# EAGLE board DynoHub (EAGLE 9.6.2)
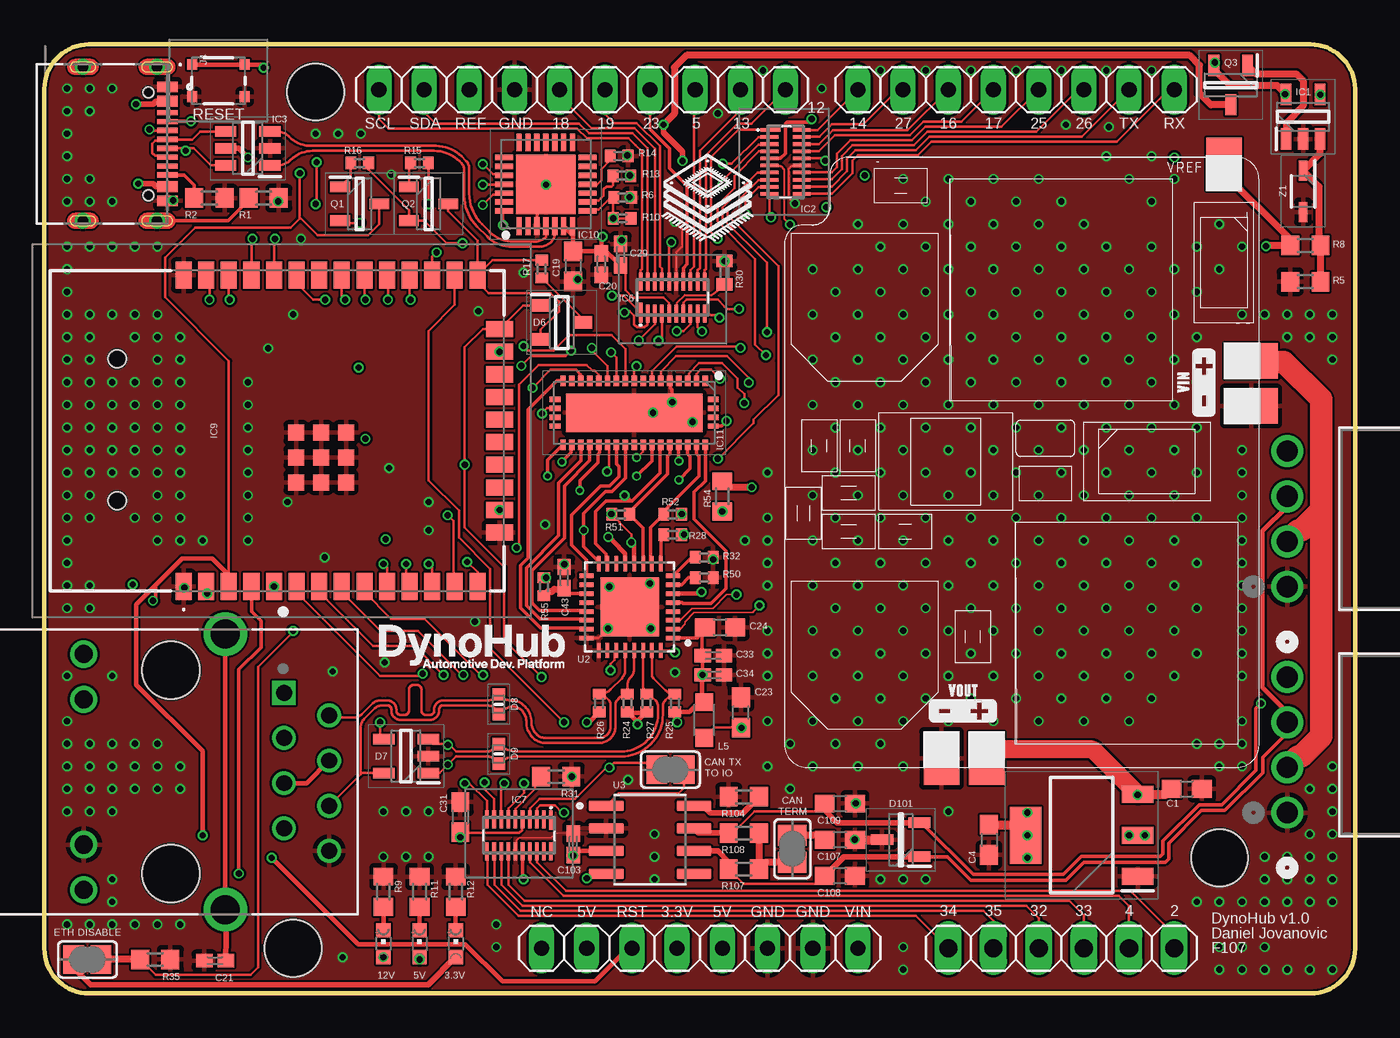
[diagram p5: board, top side]
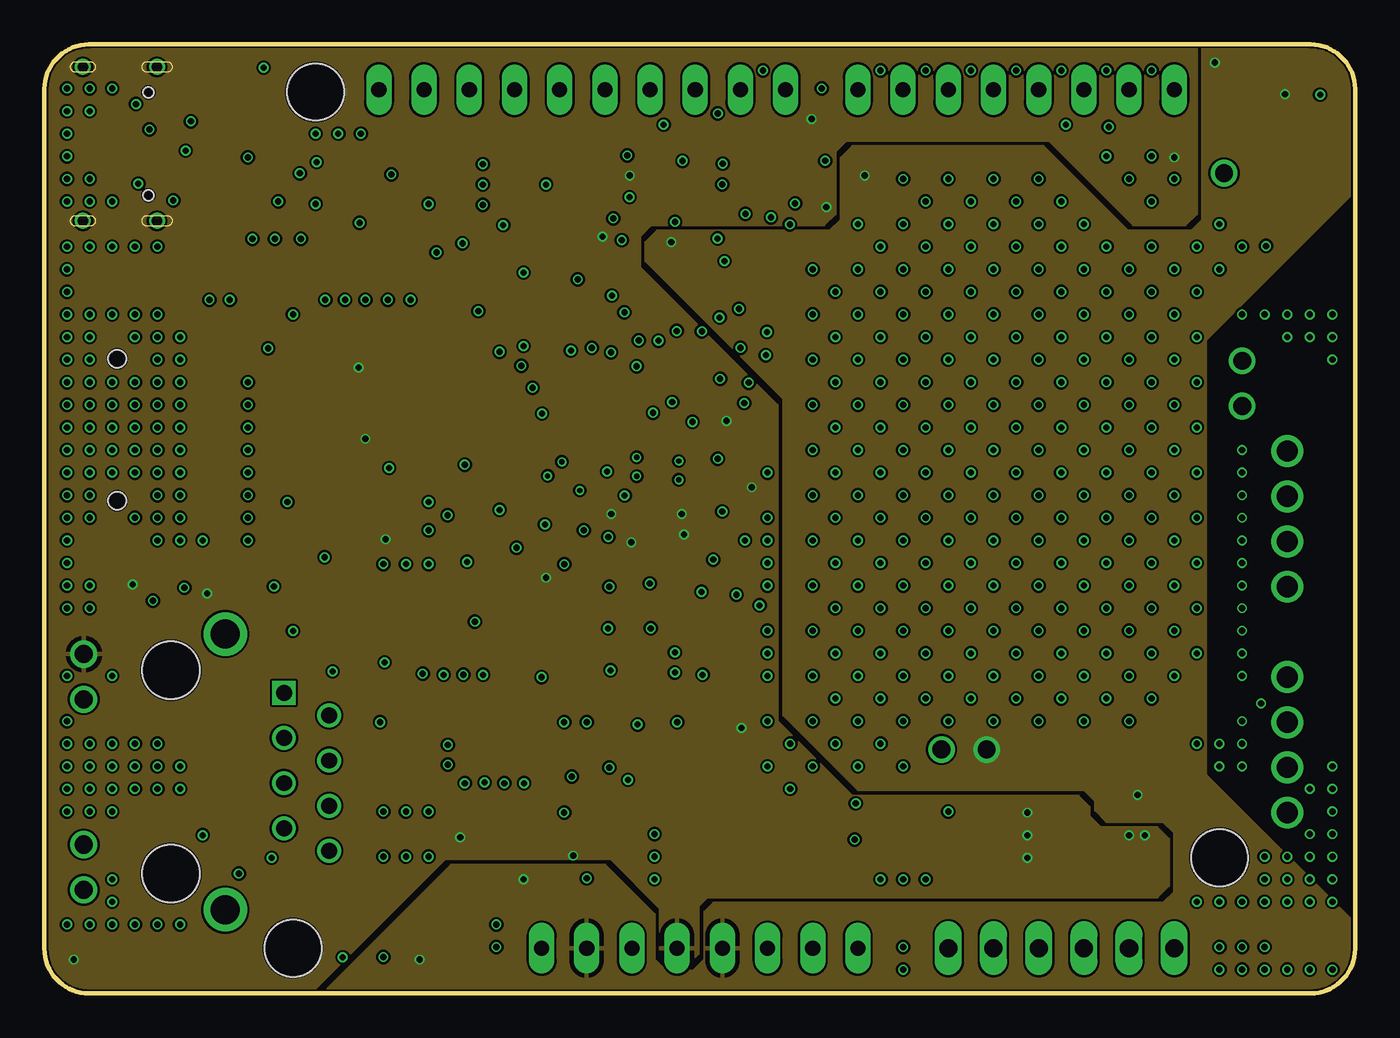
[diagram p6: board, inner layer Route2]
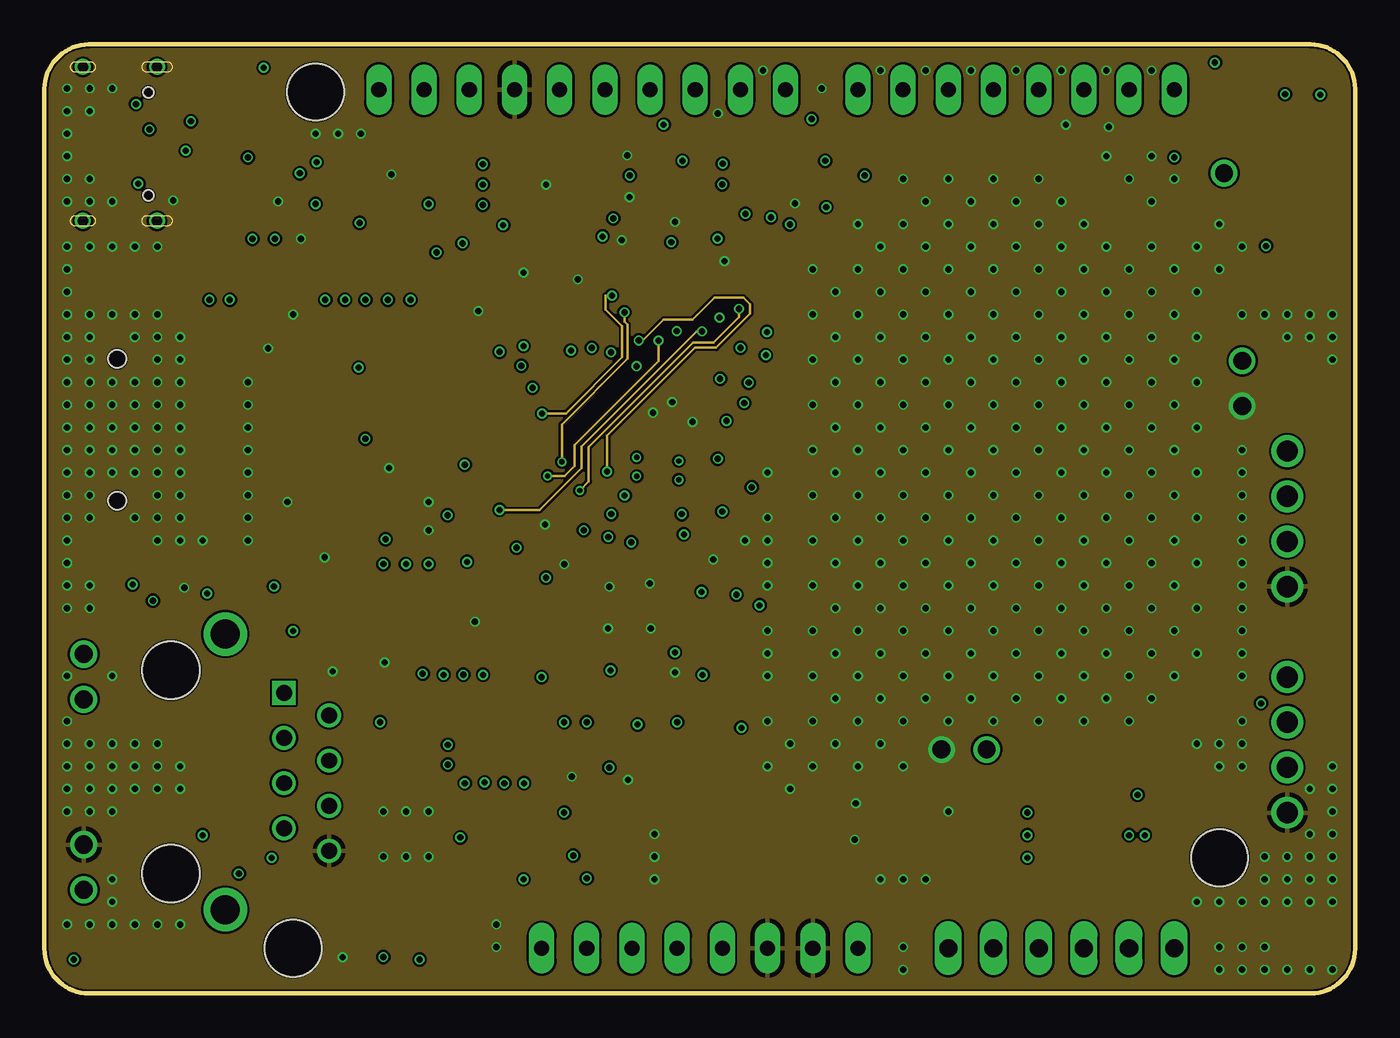
[diagram p7: board, inner layer Route15]
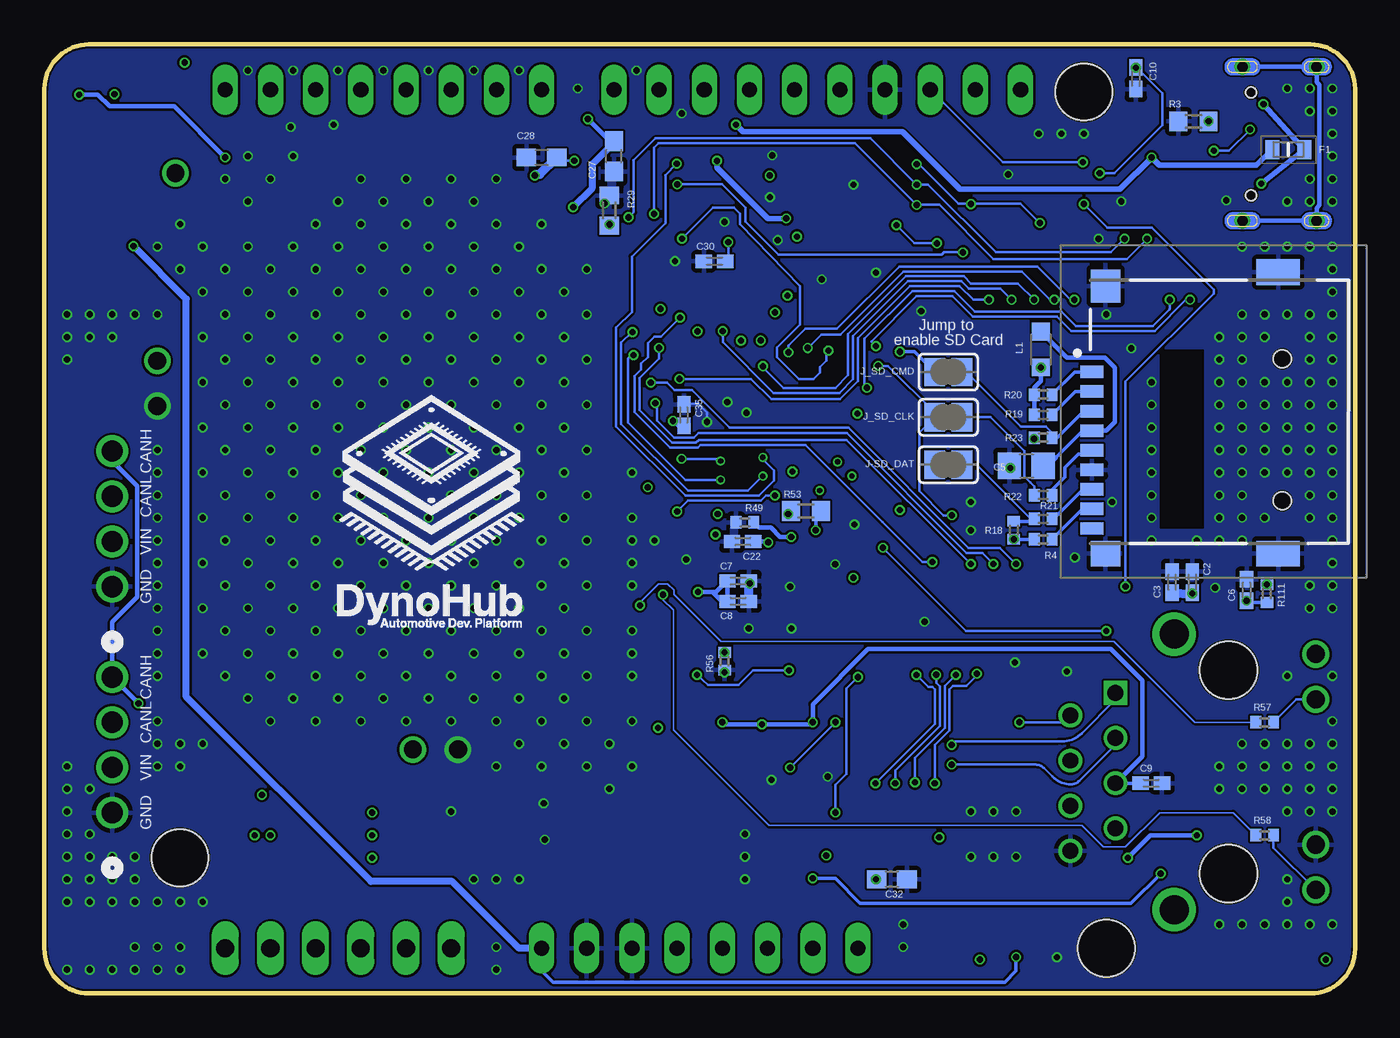
[diagram p8: board, bottom side, seen from below]

Size 73.66 x 53.34 mm. Coordinates in mm from the lower left corner, seen from the top.
Outline: 0,50.84 0,2.5 arc90 2.5,0 71.16,0 arc90 73.66,2.5 73.66,50.84 arc90 71.16,53.34 2.5,53.34 arc90 0,50.84
Copper layers (1*2*15*16): Top 0.035559375mm / dielectric 0.17018125mm / Route2 0.01778125mm / dielectric 47mil / Route15 0.01778125mm / dielectric 0.17018125mm / Bottom 0.035559375mm
Design rules "jlcpcb-4-layer *": minimum track width 3.5mil, minimum drill 0.2mm, track to track 0.126490625mm, track to pad 0.126490625mm, pad to pad 0.126490625mm, via to via 0.126490625mm, smd to smd 0mil, copper to edge 0.1mm, drill to drill 5mil, minimum pad ring 4mil, minimum via ring 4mil, stop-mask expansion 3mil, vias tented up to drill 100mil, thermal gap 10mil
Holes 3.2 mm at 66.04,7.62 15.24,50.67 13.97,2.54

## Footprints (pad centres in the part's own frame; a part is rotated, then mirrored left to right if it is on the bottom)
CHIPLED_0603 = smd 0.8 x 0.8: A 0,-0.75; C 0,0.75
C0603 = smd 1.1 x 1: 1 -0.85,0; 2 0.85,0
C0402K = smd 0.925 x 0.74: 1 -0.6,0; 2 0.6,0
C0805 = smd 1.3 x 1.5: 1 -0.95,0; 2 0.95,0
SJ = smd 1.168 x 1.6: 1 -0.762,0; 2 0.762,0
SOT95P240X120-3N = smd 1 x 0.7: 1 -1.2,0.95; 2 -1.2,-0.95; 3 1.2,0
SOT95P280X145-5N = smd 1.2 x 0.6: 1 -1.25,0.95; 2 -1.25,0; 3 -1.25,-0.95; 4 1.25,-0.95; 5 1.25,0.95
DIONC1006X55N = smd 0.7 x 0.7: 1 -0.55,0; 2 0.55,0
SOT96P237X111-3N = smd 1.25 x 0.6: 1 -1.05,0.955; 2 -1.05,-0.955; 3 1.05,0
FUSC1608X70N = smd 0.77 x 1.07: 1 -0.9,0; 2 0.9,0
TXB0108DQSR = smd 0.2 x 1.1: 1 -1.8,-0.85 | smd 0.2 x 1: 2 -1.4,-0.9; 3 -1,-0.9; 4 -0.6,-0.9; 5 -0.2,-0.9; 6 0.2,-0.9; 7 0.6,-0.9; 8 1,-0.9; 9 1.4,-0.9; 10 1.8,-0.9; 11 1.8,0.9; 12 1.4,0.9; 13 1,0.9; 14 0.6,0.9; 15 0.2,0.9; 16 -0.2,0.9; 17 -0.6,0.9; 18 -1,0.9; 19 -1.4,0.9; 20 -1.8,0.9
SOT95P280X145-6N = smd 1.2 x 0.6: 1 -1.25,0.95; 2 -1.25,0; 3 -1.25,-0.95; 4 1.25,-0.95; 5 1.25,0; 6 1.25,0.95
SOT230P700X180-4N = smd 1.75 x 0.95: 1 -3.15,2.3; 2 -3.15,0; 3 -3.15,-2.3 | smd 1.75 x 3.2: 4 3.15,0
ESP32WROOM32EN8R2 = smd 1.5 x 0.9: 1 -8.75,5.26; 2 -8.75,3.99; 3 -8.75,2.72; 4 -8.75,1.45; 5 -8.75,0.18; 6 -8.75,-1.09; 7 -8.75,-2.36; 8 -8.75,-3.63; 9 -8.75,-4.9; 10 -8.75,-6.17; 11 -8.75,-7.44; 12 -8.75,-8.71; 13 -8.75,-9.98; 14 -8.75,-11.25; 25 8.75,-11.25; 26 8.75,-9.98; 27 8.75,-8.71; 28 8.75,-7.44; 29 8.75,-6.17; 30 8.75,-4.9; 31 8.75,-3.63; 32 8.75,-2.36; 33 8.75,-1.09; 34 8.75,0.18; 35 8.75,1.45; 36 8.75,2.72; 37 8.75,3.99; 38 8.75,5.26 | smd 0.9 x 1.5: 15 -5.715,-12.5; 16 -4.445,-12.5; 17 -3.175,-12.5; 18 -1.905,-12.5; 19 -0.635,-12.5; 20 0.635,-12.5; 21 1.905,-12.5; 22 3.175,-12.5; 23 4.445,-12.5; 24 5.715,-12.5 | smd 0.9 x 0.9: 39 -1.5,-2.46; 40 -2.9,-2.46; 41 -2.9,-3.86; 42 -1.5,-3.86; 43 -0.1,-3.86; 44 -0.1,-2.46; 45 -0.1,-1.06; 46 -1.5,-1.06; 47 -2.9,-1.06
QFN50P500X500X80-29N = smd 1 x 0.3: 1 -2.35,1.5; 2 -2.35,1; 3 -2.35,0.5; 4 -2.35,0; 5 -2.35,-0.5; 6 -2.35,-1; 7 -2.35,-1.5; 15 2.35,-1.5; 16 2.35,-1; 17 2.35,-0.5; 18 2.35,0; 19 2.35,0.5; 20 2.35,1; 21 2.35,1.5 | smd 0.3 x 1: 8 -1.5,-2.35; 9 -1,-2.35; 10 -0.5,-2.35; 11 0,-2.35; 12 0.5,-2.35; 13 1,-2.35; 14 1.5,-2.35; 22 1.5,2.35; 23 1,2.35; 24 0.5,2.35; 25 0,2.35; 26 -0.5,2.35; 27 -1,2.35; 28 -1.5,2.35 | smd 3.35 x 3.35: 29 0,0
QFN50P350X900X80-43N = smd 0.6 x 0.3: 1 -1.8,4; 2 -1.8,3.5; 3 -1.8,3; 4 -1.8,2.5; 5 -1.8,2; 6 -1.8,1.5; 7 -1.8,1; 8 -1.8,0.5; 9 -1.8,0; 10 -1.8,-0.5; 11 -1.8,-1; 12 -1.8,-1.5; 13 -1.8,-2; 14 -1.8,-2.5; 15 -1.8,-3; 16 -1.8,-3.5; 17 -1.8,-4; 22 1.8,-4; 23 1.8,-3.5; 24 1.8,-3; 25 1.8,-2.5; 26 1.8,-2; 27 1.8,-1.5; 28 1.8,-1; 29 1.8,-0.5; 30 1.8,0; 31 1.8,0.5; 32 1.8,1; 33 1.8,1.5; 34 1.8,2; 35 1.8,2.5; 36 1.8,3; 37 1.8,3.5; 38 1.8,4 | smd 0.3 x 0.6: 18 -0.75,-4.45; 19 -0.25,-4.45; 20 0.25,-4.45; 21 0.75,-4.45; 39 0.75,4.45; 40 0.25,4.45; 41 -0.25,4.45; 42 -0.75,4.45 | smd 2.15 x 7.65: 43 0,0
HRO_TYPE-C-31-M-12 = smd 0.6 x 1.14: A1_B12 -3.2,4.75; A4_B9 -2.4,4.75; B1_A12 3.2,4.75; B4_A9 2.4,4.75 | smd 0.3 x 1.14: A5 -1.25,4.75; A6 -0.25,4.75; A7 0.25,4.75; A8 1.25,4.75; B5 1.75,4.75; B6 0.75,4.75; B7 -0.75,4.75; B8 -1.75,4.75 | drill 0.6 pad 0.9: S1 -4.325,4.17; S2 4.325,4.17; S3 -4.325,0; S4 4.325,0 | hole 0.6: -2.89,3.68; 2.89,3.68
CONN_SD-171857-0001_M265_04_MO = drill 1.194 pad 1.702: 1 0,0; 2 2.54,0; 3 5.08,0; 4 7.62,0
HANRUN_HR911105A = drill 0.89 square: 1 4.45,-6.35 | drill 0.89: 2 3.18,-8.89; 3 1.91,-6.35; 4 0.64,-8.89; 5 -0.63,-6.35; 6 -1.9,-8.89; 7 -3.17,-6.35; 8 -4.44,-8.89 | drill 1.02: 9 6.625,4.9; 10 4.085,4.9; 11 -4.085,4.9; 12 -6.625,4.9 | drill 1.63: 15 7.745,-3.05; 16 -7.745,-3.05 | hole 3.25: -5.715,0; 5.715,0
1X06 = drill 1.016 long: 1 -6.35,0; 2 -3.81,0; 3 -1.27,0; 4 1.27,0; 5 3.81,0; 6 6.35,0
1X10 = drill 0.85 pad 1.422 long: 1 -11.43,0; 2 -8.89,0; 3 -6.35,0; 4 -3.81,0; 5 -1.27,0; 6 1.27,0; 7 3.81,0; 8 6.35,0; 9 8.89,0; 10 11.43,0
1X08 = drill 0.85 pad 1.422 long: 1 -8.89,0; 2 -6.35,0; 3 -3.81,0; 4 -1.27,0; 5 1.27,0; 6 3.81,0; 7 6.35,0; 8 8.89,0
L2012C = smd 1 x 1: 1 -1,0; 2 1,0
TF-01A = smd 0.7 x 1.3: 1 2.23,7.174; 2 1.13,7.174; 3 0.03,7.174; 4 -1.07,7.174; 5 -2.17,7.174; 6 -3.27,7.174; 7 -4.37,7.174; 8 -5.47,7.174; CD1 -6.57,7.174 | smd 1.448 x 1.651: MP1 -7.989,6.4 | smd 1.448 x 2.438: MP2 -7.989,-3.3; MP3 7.836,-3.3 | smd 1.854 x 1.651: MP4 7.061,6.4 | hole 1: -5.004,-3.531; 2.972,-3.531
SOT95P240X115-3N = smd 1.1 x 0.6: 1 -1.1,0.95; 2 -1.1,-0.95; 3 1.1,0
SOT95P237X112-3N = smd 1.2 x 0.6: 1 -1.1,0.95; 2 -1.1,-0.95; 3 1.1,0
R0603 = smd 1 x 1.1: 1 -0.85,0; 2 0.85,0
R0402 = smd 0.6 x 0.7: 1 -0.5,0; 2 0.5,0
R0402' = smd 0.7 x 0.9: 1 -0.65,0; 2 0.65,0
EVPAF5B70 = smd 0.55 x 0.6: A1 -1.475,0.9; A2 1.475,0.9; B1 -1.475,-0.9; B2 1.475,-0.9
QFN50P500X500X100-33N = smd 0.86 x 0.26: 1 -2.435,1.75; 2 -2.435,1.25; 3 -2.435,0.75; 4 -2.435,0.25; 5 -2.435,-0.25; 6 -2.435,-0.75; 7 -2.435,-1.25; 8 -2.435,-1.75; 17 2.435,-1.75; 18 2.435,-1.25; 19 2.435,-0.75; 20 2.435,-0.25; 21 2.435,0.25; 22 2.435,0.75; 23 2.435,1.25; 24 2.435,1.75 | smd 0.26 x 0.86: 9 -1.75,-2.435; 10 -1.25,-2.435; 11 -0.75,-2.435; 12 -0.25,-2.435; 13 0.25,-2.435; 14 0.75,-2.435; 15 1.25,-2.435; 16 1.75,-2.435; 25 1.75,2.435; 26 1.25,2.435; 27 0.75,2.435; 28 0.25,2.435; 29 -0.25,2.435; 30 -0.75,2.435; 31 -1.25,2.435; 32 -1.75,2.435 | smd 3.3 x 3.3: 33 0,0
SOIC127P599X175-8N = smd 1.97 x 0.6: 1 -2.47,1.905; 2 -2.47,0.635; 3 -2.47,-0.635; 4 -2.47,-1.905; 5 2.47,-1.905; 6 2.47,-0.635; 7 2.47,0.635; 8 2.47,1.905
2X3MM_PAD = smd 2 x 3: P$1 0,0
SOD2713X115N = smd 1.125 x 0.5: 1 -1.162,0; 2 1.162,0

## Placement (x,y rotation side)
3.3V  C965807  [CHIPLED_0603]  23.11,2.79 0 top
5V  C965807  [CHIPLED_0603]  21.08,2.79 0 top
12V  C965807  [CHIPLED_0603]  19.05,2.79 0 top
C1  1uF  [C0603]  64.2,11.49 0 top
C2  100nF  [C0402K]  9.14,23.11 90 bottom
C3  4.7uF  [C0402K]  10.29,23.11 90 bottom
C4  1uF  [C0603]  53.09,8.64 270 top
C5  47uF  [C0805]  18.48,29.65 0 bottom
C6  100nF  [C0402K]  6.1,22.67 90 bottom
C7  100nF  [C0402K]  34.67,23.18 0 bottom
C8  2.2uF  [C0402K]  34.67,22.03 0 bottom
C9  100nF  [C0402K]  11.46,11.81 0 bottom
C10  100 nF  [C0402K]  12.32,51.44 270 bottom
C19  4.7uF  [C0603]  29.71,40.86 270 top
C20  100nF  [C0402K]  31.3,40.99 270 top
C21  1nF  [C0402K]  9.59,1.84 180 top
C22  100nF  [C0402K]  34.42,25.4 180 bottom
C23  22uF  [C0603]  39.14,15.79 90 top
C24  22uF  [C0603]  37.97,20.57 0 top
C27  100nF  [C0603]  41.66,47.05 90 bottom
C28  100nF  [C0603]  45.72,46.99 0 bottom
C29  100nF  [C0402K]  32.38,41.53 270 top
C30  100nF  [C0402K]  36,41.15 0 bottom
C31  100nF  [C0603]  23.37,9.91 270 top
C32  100nF  [C0603]  26.04,6.41 180 bottom
C33  100nF  [C0402K]  37.59,18.99 0 top
C34  100nF  [C0402K]  37.59,17.91 0 top
C35  100nF  [C0402K]  37.72,32.51 270 bottom
C43  1nF  [C0402K]  29.21,23.37 90 top
C103  100 nF  [C0402K]  29.72,8.38 90 top
C107  4.7nF 100V  [C0603]  44.7,8.64 180 top
C108  100pF 50V  [C0603]  44.7,6.6 180 top
C109  100pF 50V  [C0603]  44.7,10.67 180 top
CAN_TX  [SJ]  35.18,12.57 0 top
D6  BAT54C  [SOT95P240X120-3N]  29.08,37.72 0 top
D7  ESDS314DBVR  [SOT95P280X145-5N]  20.32,13.34 180 top
D8  GG0402052R542P  [DIONC1006X55N]  25.53,16.26 90 top
D9  GG0402052R542P  [DIONC1006X55N]  25.53,13.46 270 top
D101  NUP2105LT1G  [SOT96P237X111-3N]  48.13,8.64 180 top
ETH_EN  [SJ]  2.41,1.91 0 top
F1  MF-FSML050_8-2  [FUSC1608X70N]  3.75,47.43 180 bottom
IC1  LMV321AIDBVR  [SOT95P280X145-5N]  70.74,49.28 90 top
IC2  TXB0108DQSR  [TXB0108DQSR]  41.66,46.74 270 top
IC3  USBLC6-2SC6  [SOT95P280X145-6N]  11.43,47.5 180 top
IC4  TLV1117LV33DCYR  [SOT230P700X180-4N]  58.29,8.89 180 top
IC6  TXB0108DQSR  [TXB0108DQSR]  35.31,39.12 0 top
IC7  TXB0108DQSR  [TXB0108DQSR]  26.67,8.89 180 top
IC9  ESP32-WROOM-32E-N8R2  [ESP32WROOM32EN8R2]  13.08,31.62 90 top
IC10  CP2102N-A02-GQFN28R  [QFN50P500X500X80-29N]  28.18,45.48 90 top
IC11  TS3L501ERUAR  [QFN50P350X900X80-43N]  33.15,32.64 270 top
J4  TYPE-C-31-M-12  [HRO_TYPE-C-31-M-12]  2.16,47.75 270 top
J5  1718570004CONN_SD-171857-0001_M265_04_MO  [CONN_SD-171857-0001_M265_04_MO]  69.85,22.86 90 top
J6  1718570004CONN_SD-171857-0001_M265_04_MO  [CONN_SD-171857-0001_M265_04_MO]  69.85,10.16 90 top
J9  HR911105A  [HANRUN_HR911105A]  7.11,12.45 90 top
J-SD_DAT  [SJ]  22.86,29.72 0 bottom
J_SD_CLK  [SJ]  22.86,32.38 0 bottom
J_SD_CMD  [SJ]  22.86,34.92 0 bottom
JANALOG1  6x1F-H8.5-L14.5mm  [1X06]  57.15,2.54 0 top
JHIGH1  10x1F-H8.5-L14.5mm  [1X10]  30.23,50.8 180 top
JLOW1  8x1F-H8.5-L14.5mm  [1X08]  54.61,50.8 180 top
L1  600R 2A  [L2012C]  17.65,36.2 90 bottom
L5  600R 2A  [L2012C]  37.08,15.37 90 top
MICRO_SD1  TF-01A  [TF-01A]  7.62,32.7 90 bottom
POWER1  8x1F-H8.5-L14.5mm  [1X08]  36.83,2.54 0 top
Q1  SS8050-G  [SOT95P240X115-3N]  17.72,44.39 0 top
Q2  SS8050-G  [SOT95P240X115-3N]  21.59,44.39 0 top
Q3  FDN340P  [SOT95P237X112-3N]  66.67,51.05 270 top
R1  1M  [R0603]  12.32,44.7 180 top
R2  5K1  [R0603]  9.27,44.7 180 top
R3  5K1  [R0603]  9.08,49.02 0 bottom
R4  2.2k  [R0402]  17.53,25.53 180 bottom
R5  10k  [R0603]  70.87,40.01 0 top
R6  47.5k 5%  [R0402]  32.5,44.73 180 top
R8  10k  [R0603]  70.87,42.04 180 top
R9  470  [R0603]  19.05,5.71 270 top
R10  22.1k 5%  [R0402]  32.47,43.56 180 top
R11  100  [R0603]  21.08,5.71 270 top
R12  15  [R0603]  23.11,5.71 270 top
R13  2k 5%  [R0402]  32.46,45.95 180 top
R14  10k 5%  [R0402]  32.3,47.07 180 top
R15  10k 5%  [R0402]  21.08,46.67 0 top
R16  10k 5%  [R0402]  17.72,46.67 0 top
R17  220  [R0402]  27.94,40.72 90 top
R18  2.2k  [R0402]  19.18,26.04 270 bottom
R19  2.2k  [R0402]  17.53,32.51 180 bottom
R20  2.2k  [R0402]  17.53,33.66 180 bottom
R21  10  [R0402]  17.53,26.67 180 bottom
R22  220  [R0402]  17.53,28 180 bottom
R23  10k  [R0402]  17.53,31.24 180 bottom
R24  49,9 1%  [R0402]  32.77,16.32 270 top
R25  49,9 1%  [R0402]  35.43,16.32 270 top
R26  49,9 1%  [R0402]  31.18,16.32 270 top
R27  49,9 1%  [R0402]  33.85,16.32 270 top
R28  2.2k  [R0402]  35.31,25.78 0 top
R29  10k  [R0603]  41.91,44.01 270 bottom
R30  10k  [R0402']  38.23,40.51 270 top
R31  10k  [R0603]  28.77,12.19 180 top
R32  2.2k  [R0402]  37.08,24.51 0 top
R35  10k  [R0603]  6.22,1.91 180 top
R49  2.2k  [R0402]  34.29,26.48 180 bottom
R50  2.2k  [R0402]  37.08,23.37 0 top
R51  2.2k  [R0402]  32.38,26.92 180 top
R52  2.2k  [R0402]  35.31,26.92 0 top
R53  2.2k  [R0603]  30.86,27.11 180 bottom
R54  2.2k  [R0603]  38.1,27.94 90 top
R55  10k  [R0402]  28.07,22.86 90 top
R56  12k 1%  [R0402]  35.43,18.67 90 bottom
R57  2.2k  [R0402]  5.08,15.24 0 bottom
R58  2.2k  [R0402]  5.08,8.89 0 bottom
R104  47K  [R0603]  39.31,11.05 0 top
R107  59  [R0603]  39.31,6.99 180 top
R108  59  [R0603]  39.31,9.02 0 top
R111  10K  [R0402]  4.95,22.48 90 bottom
S3  EVP-AF5B70  [EVPAF5B70]  9.78,51.31 0 top
SJ1  [SJ]  42.04,8.13 270 top
U2  LAN8710A-EZC  [QFN50P500X500X100-33N]  32.89,21.72 180 top
U3  SN65HVD230  [SOIC127P599X175-8N]  34.04,8.64 0 top
U$1  NC  [NC]  77.36,53.33 0 top  (outside the outline)
U$2  NC  [NC]  77.36,52.06 0 top  (outside the outline)
U$3  NC  [NC]  77.36,50.79 0 top  (outside the outline)
U$4  NC  [NC]  77.36,49.52 0 top  (outside the outline)
U$5  NC  [NC]  77.36,48.25 0 top  (outside the outline)
U$6  NC  [NC]  77.36,46.98 0 top  (outside the outline)
U$7  NC  [NC]  77.36,45.71 0 top  (outside the outline)
U$8  2X3MM_PAD  [2X3MM_PAD]  52.96,13.21 0 top
U$9  2X3MM_PAD  [2X3MM_PAD]  66.29,46.61 180 top
U$10  2X3MM_PAD  [2X3MM_PAD]  67.82,35.56 90 top
U$11  2X3MM_PAD  [2X3MM_PAD]  50.42,13.21 0 top
U$12  2X3MM_PAD  [2X3MM_PAD]  67.82,33.02 90 top
U$13  NC  [NC]  77.25,53.07 0 top  (outside the outline)
U$14  NC  [NC]  77.25,51.8 0 top  (outside the outline)
U$15  NC  [NC]  77.25,50.53 0 top  (outside the outline)
U$16  NC  [NC]  77.25,49.26 0 top  (outside the outline)
U$17  NC  [NC]  77.25,47.99 0 top  (outside the outline)
U$18  NC  [NC]  77.25,46.72 0 top  (outside the outline)
U$19  NC  [NC]  77.25,45.45 0 top  (outside the outline)
U$20  NC  [NC]  77.25,53.39 0 top  (outside the outline)
U$21  NC  [NC]  77.25,52.12 0 top  (outside the outline)
U$22  NC  [NC]  77.25,50.85 0 top  (outside the outline)
U$23  NC  [NC]  77.25,49.58 0 top  (outside the outline)
U$24  NC  [NC]  77.25,48.31 0 top  (outside the outline)
U$25  NC  [NC]  77.25,47.04 0 top  (outside the outline)
U$26  NC  [NC]  77.25,45.77 0 top  (outside the outline)
U$27  NC  [NC]  77.25,53.39 0 top  (outside the outline)
U$28  NC  [NC]  77.25,52.12 0 top  (outside the outline)
U$29  NC  [NC]  77.25,50.85 0 top  (outside the outline)
U$30  NC  [NC]  77.25,49.58 0 top  (outside the outline)
U$31  NC  [NC]  77.25,48.31 0 top  (outside the outline)
U$32  NC  [NC]  77.25,47.04 0 top  (outside the outline)
U$33  NC  [NC]  77.25,45.77 0 top  (outside the outline)
U$34  NC  [NC]  77.25,44.5 0 top  (outside the outline)
U$35  NC  [NC]  77.25,43.23 0 top  (outside the outline)
Z1  BZX384C5V1-HE3-08  [SOD2713X115N]  70.74,45.09 270 top

## Tracks (layer width: path | path; a pad name or v marks a point on that pad's centre or on a via)
3V3  (via drill 0.35)
  Top 0.089: R28.2 35.83,25.8 v35.94,25.8 | R52.2 v35.82,26.94 | R51.2 v31.86,26.94
  Top 0.152: C29.2 32.65,40.61 32.65,39.52 33.06,39.11 34.8,39.11 35.11,38.81 IC6.5 | IC7.5 26.85,9.77 26.85,9.18 26.68,9.01 23.37,9.01 C31.2 | IC4.4 v55.24,8.89 | IC4.4 55.24,8.99 v55.24,10.16 | IC4.4 55.24,8.79 v55.24,7.62 | v60.96,8.89 IC4.2 v61.85,8.89 | IC9.2 9.09,23.44 | IC1.4 v71.7,50.52 | R51.2 32.31,26.5 32.31,26.46 32.98,25.78 v32.98,25.36 | R55.2 v28.19,23.37 | C103.1 v29.72,7.75 | L5.1 37.65,14.94 C23.1 v39.16,14.94 v39.17,14.93
  Top 0.2: IC2.5 41.38,46.94 41.66,47.21 41.66,48.9
  Top 0.203: IC11.39 38.04,31.89 v38.33,32.18 | 41.66,48.9 41.72,48.96 42.93,48.96 v43.12,49.15 | C31.2 v23.37,8.76
  Top 0.254: U2.12 33.14,24.76 33.15,24.77 33.15,25.19 v32.98,25.36 | C103.1 29.99,8 U3.3 | IC10.7 29.71,43.1 C19.1 | C19.1 29.71,42.6 IC10.6 | C20.1 31.22,41.71 C19.1 | C20.1 31.62,41.64 C29.2 | v31.37,42.55 31.3,42.47 C20.1 | R13.1 32.91,45.95 v32.89,45.97 | v9.14,22.48 9.14,22.82 IC9.2
  Top 0.305: ETH_EN.1 1.65,1.42 2.59,0.48 21.55,0.48 3.3V.A
  Top 0.406: v39.75,28.45 38.44,28.45 R54.2
  Top 0.508: C4.1 54.57,9.49 v55.24,10.16
  Bottom 0.152: R19.2 | R53.2 31.86,26.96 v31.86,26.94 | R18.2 v19.18,25.53
  Bottom 0.203: v38.33,32.18 38.01,31.86 C35.2 | v19.17,25.53 R4.2
  Bottom 0.254: v32.98,25.36 33.03,25.4 C22.1 | v43.12,49.15 41.87,47.9 C27.2 | v71.7,50.52 70.67,50.52 70.01,49.86 66.37,49.86 v63.5,46.99 | L1.1 v17.65,35.18 17.65,34.42 18.03,34.04 R20.2 18.03,32.53 R19.2 | R23.2 v18.03,31.18 | R18.2 v19.17,25.53 | C2.1 9.16,22.46
  Bottom 0.406: v43.94,44.2 42.86,45.27 42.86,46.62 41.66,47.82 C27.2
  Bottom 0.508: C3.1 9.16,22.46 v9.14,22.48
  other vias: 1.65,1.91 4.95,22.98
  pour Route2: 64.77,53.34 64.77,43.81 64.14,43.18 61.21,43.18 56.45,47.94 45.09,47.94 44.45,47.31 44.45,43.81 43.81,43.18 34.1,43.18 33.46,42.55 33.46,40.83 41.21,33.08 41.21,15.3 45.4,11.11 58.1,11.11 58.74,10.48 58.74,9.97 59.37,9.33 62.55,9.33 63.18,8.7 63.18,6.03 62.55,5.4 37.27,5.4 36.77,4.89 36.77,2.22 36.13,1.59 35.24,1.59 34.61,2.22 34.61,4.76 31.81,7.56 22.54,7.56 14.99,0 2.54,0 arc-90 0,2.54 0,50.8 arc-90 2.54,53.34
5V  (via drill 0.35, 1)
  Top 0.152: IC2.16 43.75,46.94 v43.88,46.8 | IC6.16 35.11,40.66 35.11,42.11 v35.23,42.23 | IC1.5 69.74,50.53 v69.72,50.55 | 5V.A v21.08,1.91 | U$8.P$1 v52.96,13.71
  Top 0.2: IC7.16 26.87,6.47 v26.92,6.41
  Top 0.406: IC1.5 69.29,51.02 66.65,51.02 65.72,51.95 Q3.2
  Top 0.508: C1.1 63.05,11.19 IC4.3 v61.44,11.16
  Top 1.016: IC4.3 58.92,13.71 v52.96,13.71
  Bottom 0.152: v43.88,46.8 44.68,46.8 C28.2 | C30.2 35.23,41.27 v35.23,42.23
  Bottom 0.2: v26.92,6.41 C32.2
  Bottom 0.508: v46.1,45.97 46.04,46.04 45.83,46.04 C28.2
  other vias: 65.79,52.32
  pour Route2: 22.86,7.24 31.5,7.24 34.29,4.45 34.29,1.91 34.92,1.27 36.45,1.27 37.08,1.91 37.08,4.57 37.59,5.08 62.87,5.08 63.5,5.71 63.5,9.02 62.87,9.65 59.69,9.65 59.05,10.29 59.05,10.79 58.42,11.43 45.72,11.43 41.53,15.62 41.53,33.4 33.78,41.15 33.78,42.23 34.42,42.86 44.13,42.86 44.77,43.5 44.77,46.99 45.4,47.62 56.13,47.62 60.9,42.86 64.45,42.86 65.09,43.5 65.09,53.34 71.12,53.34 arc-90 73.66,50.8 73.66,45.09 65.28,36.7 65.28,12.32 73.66,3.94 73.66,2.54 arc-90 71.12,0 15.62,0
12V  (via drill 0.35, 1)
  Top 0.152: U$9.P$1 v66.29,46.11
  Top 0.203: 68.68,42.04 v68.66,42.01
  Top 0.406: v66.29,46.11 70.02,42.39 R8.2 68.68,42.04
  Bottom 0.203: POWER1.8 45.72,1.27 45.09,0.64 19.68,0.64 19.05,1.27 12V.A
  Bottom 0.406: v68.66,42.01 65.68,39.04 65.68,16.66 55.31,6.29 50.74,6.29 46.99,2.54 POWER1.8
  other vias: 19.05,2.04
!ETH_EN  (via drill 0.35)
  Top 0.15: 31.15,34.78 IC11.13
  Top 0.152: R35.2 6.24,1.04 11.58,1.04 12,1.46 12,18.35 13.97,20.32 v13.97,20.38 | v26.53,25.05 26.67,25.19 26.67,34.23 27.77,35.33 30.48,35.33 30.8,35.02 30.91,35.02 31.15,34.78
  Top 0.406: R35.2 ETH_EN.2
  Bottom 0.152: v13.97,20.38 21.86,20.38 v26.53,25.05
A0/ADC1_6/GPIO34  (via drill 0.35)
  Top 0.152: IC7.10 24.87,10.82 23.88,11.81 v23.62,11.81 | v21.26,17.97 21.13,17.85 18.88,17.85 14.21,22.52 14.21,22.84 IC9.6
  Bottom 0.152: v23.62,11.81 23.62,13.96 22.78,14.79 22.78,17.09 22.61,17.27 21.84,17.27 21.26,17.86 v21.26,17.97
A0/ADC1_6/GPIO34_5V
  Top 0.152: IC7.11 24.89,7.97 24.89,6.11 26.64,4.36 48.98,4.36 JANALOG1.1
A1/ADC1_7/GPIO35  (via drill 0.35)
  Top 0.152: IC7.9 25.27,10.93 24.73,11.46 v24.73,11.85 | IC9.7 15.41,22.84 15.41,22.58 18.47,19.53 20.79,19.53 22.41,17.91 v22.43,17.91
  Bottom 0.152: v24.73,11.85 24.73,13.24 23.06,14.91 23.06,17.27 v22.43,17.91
A1/ADC1_7/GPIO35_5V
  Top 0.15: 26.75,4.65 52.78,4.65
  Top 0.152: IC7.12 25.29,7.97 25.29,6.11 26.75,4.65 | 52.78,4.65 53.34,4.09 JANALOG1.2
A2/ADC1_4/GPIO32  (via drill 0.35)
  Top 0.152: v25.84,11.81 25.67,11.64 IC7.8 | IC9.8 16.68,22.84 16.68,22.58 18.89,20.38 20.99,20.38 23.45,17.91 v23.54,17.91
  Bottom 0.152: v25.84,11.81 25.84,12.53 23.34,15.03 23.34,17.27 23.54,17.46 v23.54,17.91
A2/ADC1_4/GPIO32_5V
  Top 0.152: IC7.13 25.69,7.97 25.69,6.11 26.87,4.93 55.18,4.93 55.88,4.23 JANALOG1.3
A3/ADC1_5/GPIO33  (via drill 0.35)
  Top 0.152: IC7.7 26.09,9.81 26.09,10.4 26.95,11.26 v26.95,11.81 | IC9.9 17.95,22.84 17.95,22.58 19.5,21.04 21.38,21.04 24.5,17.91 v24.65,17.91
  Bottom 0.152: v26.95,11.81 23.62,15.14 23.62,17.08 23.76,17.22 23.96,17.22 v24.65,17.91
A3/ADC1_5/GPIO33_5V
  Top 0.152: IC7.14 26.09,7.97 26.09,6.11 26.99,5.21 57.59,5.21 58.42,4.38 JANALOG1.4
A4/TXCAN/ADC2_0/GPIO4  (via drill 0.35)
  Top 0.152: IC9.26 23.06,38.7 21.59,37.23 21.59,28.84 23.29,27.14 23.29,25.61 25.06,23.85 25.06,19.39 v29.21,15.24 | IC7.4 27.29,9.81 27.29,10.4 27.84,10.95 29.81,10.95 31.55,12.69 v31.75,12.69 32.02,12.95 34.04,12.95 CAN_TX.1
  Bottom 0.152: v31.75,12.69 29.21,15.23 v29.21,15.24
A4/TXCAN/ADC2_0/GPIO4_5V
  Top 0.152: IC7.17 27.29,7.97 27.29,7.38 29.18,5.49 60.39,5.49 60.96,4.91 JANALOG1.5
A5/ADC2_2/SD_DAT0/GPIO2  (via drill 0.35)
  Top 0.152: D6.1 26.91,38.67 IC9.24 24.64,37.34 23.62,36.32 J-SD_DAT.1 23.62,26.18 25.84,23.96 25.84,19.88 v27.94,17.78 | v29.21,10.16 29.09,10.16 28.68,10.57 27.86,10.57 27.69,10.4 27.69,9.81 IC7.3
  Bottom 0.152: v29.21,10.16 29.21,11.71 28.57,12.35 28.57,17.14 v27.94,17.78
  other vias: 23.62,29.72
A5/ADC2_2/SD_DATO/GPIO2_5V
  Top 0.152: IC7.18 27.69,7.97 27.69,7.38 29.3,5.76 61.04,5.76 63.5,3.3 JANALOG1.6
AREF/GPI39  (via drill 0.35)
  Top 0.152: v15.3,46.72 15.3,44.43 v15.24,44.37
  Bottom 0.152: JHIGH1.8 19.8,46.72 v15.3,46.72 | v15.24,44.37 13.92,43.05 11.42,43.05 7.94,39.57 7.94,39.35 12.9,34.38 IC9.5
  other vias: 12.9,22.87
CANGND_BF_C
  Top 0.406: C107.2 43.6,8.89 SJ1.1
CANH_P  (via drill 0.35)
  Top 0.152: R108.1 38.69,9.02 39.9,10.22 43.41,10.22 | 43.41,10.22 43.92,10.22 | C109.2 43.41,10.22
  Top 0.203: D101.2 49.3,9.59 52.21,6.68 57.26,6.68 58.27,7.7 62.73,7.7 62.87,7.83 62.87,8.57 64.9,10.6 66.17,10.6 68.09,12.53 68.09,16.02 v68.37,16.3
  Top 0.305: U3.7 36.76,9.02 R108.1 | D101.2 44.55,9.59 43.92,10.22
  Bottom 0.254: J5.4 69.85,29.92 68.45,28.52 68.45,22.28 69.85,20.88 J6.4 v68.37,16.3
CANL_BF_JMP
  Top 0.406: R108.2 R107.1 40.54,7.37 SJ1.2
CANL_N
  Top 0.152: R107.2 39.28,6.16 43.43,6.16 43.85,6.58 C108.2
  Top 0.203: D101.1 50.74,7.68 52.07,6.35 57.39,6.35 58.41,7.37 62.99,7.37 63.2,7.57 63.2,8.44 65.03,10.27 66.34,10.27 68.47,12.4 68.47,13.27 69.85,14.65 J6.3
  Top 0.254: J5.3 69.85,27.38 68.45,25.98 68.45,17.2 69.85,15.8 J6.3
  Top 0.305: U3.6 37.86,8 38.46,7.41 R107.2 | D101.1 44.93,7.68 C108.2
CC1  (via drill 0.35)
  Top 0.203: J4.A5 6.93,49.02 R3.2
  other vias: 8.23,49.02
CC2
  Top 0.203: R2.2 8.42,45.43 7.85,46 J4.B5
CLK
  Bottom 0.203: R22.1 17.03,28.3 16.31,29.02 16.31,29.56 15.54,30.33 15,30.33 MICRO_SD1.5
CMP
  Top 0.406: IC1.3 71.69,47.2 Z1.1 71.63,45.36 71.63,42.12 R8.1 R5.2
CS/D10/GPIO5  (via drill 0.35)
  Top 0.152: IC6.8 36.31,37.62 35.92,37.23 v35.54,37.23 | v19.3,38.99 19.3,40.32 IC9.29
  Bottom 0.15: v19.3,38.99 19.94,39.62 21.7,39.62 22.11,40.03 25.13,40.03 28.22,36.95 28.22,34.53 28.99,33.76 30.01,33.76 32.68,33.76 35.54,36.61 v35.54,37.23
CS/D10/GPIO5_5V
  Top 0.152: IC6.13 36.31,40.65 36.5,40.84 36.5,50.72 JHIGH1.3
D0/UART_RXD  (via drill 0.35)
  Top 0.152: IC10.25 25.81,45.47 v24.64,45.47 | IC9.34 12.9,42.37 v12.95,42.42 | IC2.10 40.76,43.7 v40.83,43.62
  Bottom 0.152: v12.95,42.42 13.72,41.66 20.19,41.66 24,45.47 v24.64,45.47 27.24,48.07 39.31,48.07 40.55,46.83 40.55,43.91 v40.83,43.62
D0/UART_RXD_5V
  Top 0.152: JLOW1.1 63.2,50.8 60.27,47.88 49.85,47.88 49.09,47.12 45.72,47.12 45.4,46.8 45.4,46.11 44.25,44.96 42.58,44.96 IC2.11
D1/UART_TXD  (via drill 0.35)
  Top 0.152: IC10.26 25.8,44.96 25.4,44.96 25.35,44.91 25.21,44.91 24.64,44.33 v24.64,44.32 | IC9.35 11.63,42.37 v11.68,42.42 | IC2.9 40.73,45.31 40.14,45.31 39.41,44.58 v39.41,43.82 v39.4,43.81
  Bottom 0.152: v11.68,42.42 12.83,41.27 20.32,41.27 23.37,44.32 v24.64,44.32 28.11,47.79 39.14,47.79 39.4,47.53 v39.4,43.81
D1/UART_TXD_5V
  Top 0.152: JLOW1.2 58.32,48.16 49.74,48.16 48.98,47.4 45.57,47.4 45.1,46.93 45.1,46.21 44.25,45.36 42.58,45.36 IC2.12
D2/EMAC_RXD1/GPIO26  (via drill 0.35)
  Top 0.15: IC9.11 20.32,23.07 v20.32,24.13 | IC11.3 36.22,34.51 36.22,34.85 36.8,35.43 38.07,35.43 38.95,34.55 38.95,34.07 39.33,33.68 v39.33,33.18
  Bottom 0.15: v20.32,24.13 20.95,24.77 21.83,24.77 28.56,31.49 36.9,31.49 37.16,31.24 38.28,31.24 39.24,32.2 39.24,33.09 v39.33,33.18
D2/GPIO26  (via drill 0.3, 0.35)
  Top 0.15: v37.85,30.05 39.86,32.06 39.86,32.25 41.24,33.63 41.24,35.56
  Top 0.152: IC2.8 40.73,45.71 40.14,45.71 38.39,43.96 38.39,43.74 41.24,40.89 41.24,35.56
  Top 0.2: IC11.35 v35.65,29.93
  Bottom 0.15: v37.85,30.05 35.78,30.05 v35.65,29.93
D2/GPIO26_5V
  Top 0.152: IC2.13 42.58,45.76 44.25,45.76 44.82,46.33 44.82,47.07 45.42,47.68 48.86,47.68 49.62,48.44 55.75,48.44 58.12,50.8 JLOW1.3
D3/EMAC_RXD0/GPIO25  (via drill 0.35)
  Top 0.15: IC9.10 19.25,23.93 v19.05,24.13 | IC11.6 34.65,34.95 35.51,35.81 38.35,35.81 39.58,34.58 v39.58,34.33
  Bottom 0.15: v19.05,24.13 19.96,25.04 21.72,25.04 28.47,31.8 35.16,31.8 37.28,33.91 38.24,33.91 38.66,34.33 v39.58,34.33
D3/GPIO25  (via drill 0.3, 0.35)
  Top 0.152: IC2.7 40.06,46.14 38.11,44.18 38.11,43.56 40.61,41.06 v40.61,37.18
  Top 0.2: IC11.32 34.15,29.94 v33.28,29.07
  Bottom 0.15: 37.5,28.25 41.24,32
  Bottom 0.152: v33.28,29.07 33.28,29.11 34.13,28.25 37.5,28.25 | v40.61,37.18 40.65,37.18 41.24,36.59 41.24,32
D3/GPIO25_5V
  Top 0.152: IC2.14 42.58,46.16 44.25,46.16 44.54,46.45 44.54,47.19 45.3,47.95 48.74,47.95 49.51,48.71 53.79,48.71 JLOW1.4
D4/EMAC_CO180/GPIO17  (via drill 0.35)
  Top 0.15: IC9.28 20.52,39.04 v20.57,38.99 | IC11.2 36.65,34.82 36.88,35.05 37.47,35.05 v37.97,34.54
  Bottom 0.15: v20.57,38.99 21.46,38.99 22.23,39.75 25.02,39.75 27.94,36.83 27.94,34.42 28.96,33.4 32.8,33.4 33.95,34.54 v37.97,34.54
D4/GPIO17  (via drill 0.3, 0.35)
  Top 0.152: IC2.4 40.16,47.34 38.77,45.94 38.77,45.25 37.81,44.3 37.81,43.4 39.95,41.27 39.95,36.47 v40.55,35.87
  Top 0.2: IC11.36 36.15,30.33 36.29,30.19 36.29,29.5 v35.65,28.86
  Bottom 0.152: v35.65,28.86 37.63,28.86 40.86,32.1 40.86,35.7 40.68,35.87 v40.55,35.87
D4/GPIO17_5V
  Top 0.152: IC2.17 43.53,47.34 44.09,47.9 44.09,47.91 44.42,48.23 48.63,48.23 49.39,48.99 51.53,48.99 JLOW1.5
D5/GPIO16  (via drill 0.35)
  Top 0.152: IC2.3 40.73,47.71 40.14,47.71 38.11,45.68 38.11,45.46 v38.1,45.48 | IC9.27 21.79,41.41 v22.04,41.66
  Bottom 0.152: v22.04,41.66 23.11,41.66 23.23,41.53 32.42,41.53 34.26,43.38 34.26,44.16 35.58,45.48 v38.1,45.48
D5/GPIO16_5V
  Top 0.152: IC2.18 43.53,47.74 44.31,48.51 48.51,48.51 JLOW1.6
D6/EMAC_RX_CRS_DV/GPIO27  (via drill 0.35)
  Top 0.15: IC9.12 21.79,23.93 v21.59,24.13 | IC11.7 34.15,34.97 35.52,36.34 39.06,36.34 v39.12,36.29
  Bottom 0.15: v21.59,24.13 28.57,31.11 36.88,31.11 37.04,30.96 38.4,30.96 40.22,32.78 40.22,34.59 39.12,35.7 v39.12,36.29
D6/GPIO27  (via drill 0.3, 0.35)
  Top 0.102: IC11.31 33.65,30.48
  Top 0.152: v38.12,46.64 38.63,46.64 40.12,48.14 IC2.2 | 33.65,30.48 33.65,30.46 33.31,30.13 v33.28,30.13
  Bottom 0.15: 41.52,33.02 41.52,31.87 37.63,27.98 33.52,27.98 32.67,28.82 32.67,29.32
  Bottom 0.152: 41.52,33.02 41.52,37.42 40.64,38.3 40.64,41.43 38.77,43.3 38.77,46 v38.12,46.64 | 32.67,29.32 32.67,29.39 33.28,30 v33.28,30.13
D6/GPIO27_5V
  Top 0.152: IC2.19 42.58,48.16 43.55,48.16 44.26,48.87 46.02,48.87 47.96,50.8 JLOW1.7
D7/SD_CLK/GPIO14  (via drill 0.35)
  Top 0.152: IC2.1 39.01,48.54 37.46,46.99 37.46,42.8 v37.83,42.43 | v29.59,36.13 29.27,35.81 27.34,35.81 v26.8,35.28 | v22.66,26.88 22.99,26.54 22.99,22.95 IC9.13
  Bottom 0.152: v37.83,42.43 36.09,44.17 34.9,44.17 34.56,43.84 34.56,43.25 31.18,39.77 31.18,37.59 32.48,36.3 32.48,35.77 31.24,34.54 30.44,34.54 30.07,34.91 30.07,35.21 29.72,35.56 29.72,36 v29.59,36.13 | v26.8,35.28 26.25,35.28 23.62,32.64 J_SD_CLK.1 24.48,31.52 24.48,28.23 23.12,26.88 v22.66,26.88
D7/SD_CLK/GPIO14_5V
  Top 0.152: IC2.20 42.58,48.51 43.43,48.51 JLOW1.8
D8/GPIO12  (via drill 0.35)
  Top 0.15: 37.36,38.22 37.44,38.14 37.8,38.14 v37.95,37.99
  Top 0.152: IC6.10 37.36,38.22 | v23.75,24.26 24.33,23.68 IC9.14
  Bottom 0.15: 26.57,26.5 30.89,30.83 36.78,30.83 36.93,30.68 38.51,30.68 40.49,32.66 40.49,34.71 40.13,35.07 40.13,35.39 39.75,35.77 39.75,36.55 39.38,36.92 39.02,36.92 v37.95,37.99
  Bottom 0.152: v23.75,24.26 24.32,24.26 26.57,26.5
D8/GPIO12_5V
  Top 0.152: IC6.11 37.11,40.65 37.17,40.72 37.17,47.12 38.94,48.9 39.75,48.9 JHIGH1.1
D9/GPIO13  (via drill 0.35)
  Top 0.152: IC6.9 36.71,37.45 v36.95,37.21
  Route15 0.15: v36.95,37.21 36.65,37.21 30.19,30.75 30.19,29.54 27.83,27.18 IC9.16
  other vias: 25.58,27.18
D9/GPIO13_5V
  Top 0.152: IC6.12 36.71,40.65 36.83,40.78 36.83,47.37 39.12,49.66 JHIGH1.2
DAT0
  Bottom 0.203: MICRO_SD1.7 15.3,28.33 16.96,26.67 R21.1
DAT1
  Bottom 0.203: R4.1 15.32,27.23 MICRO_SD1.8
DAT2
  Bottom 0.203: R20.1 15.75,34.93 MICRO_SD1.1
DAT3
  Bottom 0.203: R19.1 15.71,33.83 MICRO_SD1.2
EMAC_CO180
  Top 0.2: U2.5 35.84,21.97 35.89,21.91 37.45,21.91 38.31,22.77 38.31,24.86 36.51,26.66 36.51,28.17 37.15,28.81 IC11.38
EMAC_MDC
  Top 0.2: U2.17 30.46,24.38 29.61,25.22
  Top 0.203: 29.61,25.22 29.61,26.89 31.25,28.53 31.75,28.53 32.28,29.06 32.28,29.61 32.15,29.75 IC11.28
EMAC_MDIO  (via drill 0.35)
  Top 0.2: U2.16 31.14,24.28 30.31,25.11 v30.31,26.04
  Top 0.203: IC11.29 32.65,30.4 32.65,30.39 32.65,28.96 31.89,28.2 31.55,28.2 30.31,26.96 v30.31,26.04
  Bottom 0.203: R53.1 30.31,26.82 v30.31,26.04
EMAC_RX_CRS_DV  (via drill 0.35)
  Top 0.15: 33.02,27.68 32.71,27.99 v32.61,27.99
  Top 0.2: U2.15 31.57,24.22 31.57,24.69 30.97,25.29 30.97,27.09 31.55,27.68 33.02,27.68 34.6,29.26 34.6,30.79 IC11.33
  Bottom 0.15: v32.61,27.99 33.11,27.99 33.4,27.7 37.49,27.7 R54.1
  other vias: 38.1,27.09
EMAC_RXD0
  Top 0.2: U2.11 33.64,26.16 R51.1 32.88,27.06 35.02,29.2 35.02,30.2 35.15,30.33 IC11.34
EMAC_RXD1
  Top 0.2: U2.10 34.07,24.22 34.07,26.19 R52.1 34.81,27.1 36.77,29.07 36.77,30.2 36.65,30.33 IC11.37
EMAC_TX_EN
  Top 0.2: U2.21 30.39,21.54 27.82,21.54 27.42,21.94 27.42,23.78 29.22,25.59 29.22,28.53 30.65,29.95 IC11.25
EMAC_TXD0
  Top 0.2: U2.22 30.39,21.04 27.85,21.04 27.09,21.8 27.09,23.92 28.9,25.73 28.9,28.7 30.15,29.95 IC11.24
EMAC_TXD1
  Top 0.2: U2.23 30.39,20.54 27.89,20.54 26.76,21.66 26.76,24.05 27.19,24.48 27.19,32.82 | 28.81,34.44 IC11.17
  Top 0.203: 27.19,32.82 28.81,34.44
ESP_EN  (via drill 0.35)
  Top 0.152: Q1.3 18.82,43.24 18.18,42.61 15.37,42.61 14.35,43.62 | IC9.3 10.36,35.54 6.78,39.13 6.78,41.36 8.47,43.05 13.84,43.05 14.35,43.56 14.35,43.62 | 14.35,43.62 v14.35,46.1
  Top 0.203: 6.25,22.96 6.25,22.17 C6.1
  Top 0.254: S3.A1 S3.A2 12.2,52.21 v12.32,52.03 | POWER1.3 32.79,2.54 30.93,0.68 25.74,0.68 23.65,2.77 17.61,2.77 v12.77,7.62 | v8.89,8.89 8.89,13.62 5.16,17.35 5.16,21.87 6.25,22.96 7.74,24.46 9.42,24.46 10.36,23.52 IC9.3
  Bottom 0.152: 12.09,51.86 10.82,50.59 10.82,48.8 13.53,46.1 v14.35,46.1
  Bottom 0.203: C6.1 6.06,21.98 R111.1
  Bottom 0.254: 12.09,51.86 v12.32,52.03 | v12.77,7.62 11.5,8.89 v8.89,8.89
  other vias: 6.1,22.07
ETH_LED_G
  Bottom 0.152: J9.10 3.29,16.53 R57.2
ETH_LED_Y
  Bottom 0.152: R58.2 4.58,8.19 J9.12
ETH_VDDCR  (via drill 0.35)
  Top 0.254: U2.6 36.83,22.47 v36.93,22.57
  Bottom 0.254: v36.93,22.57 35.93,22.57 C7.1 C8.1 35.58,22.04 36.11,22.57 v36.93,22.57
GND  (via drill 0.35, 1)
  Top 0.089: IC7.15 26.53,8.05 26.53,8.59 26.67,8.73 28.46,8.73 28.76,9.03 C103.2
  Top 0.102: IC6.15 35.51,41.64 35.84,41.98 35.84,42.97 v35.44,43.37 | IC2.15 42.51,46.49 41.95,46.49 41.8,46.34 41.8,44.73 42.13,44.4 v42.19,44.4
  Top 0.15: U2.33 31.14,19.97 U2.24
  Top 0.152: IC10.3 27.68,44.98 IC10.29 | v29.97,40.13 29.83,40.13 C19.2 | U$12.P$1 v67.32,33.02 | U$11.P$1 v50.42,13.71
  Top 0.203: IC11.5 35.2,34.39 35.2,34.01 35.28,33.93 v35.28,33.24
  Top 0.508: U2.33 34.02,22.84 v34.02,23.04 | C107.1 D101.3
  Bottom 0.102: v42.19,44.4 41.91,44.68 R29.1
  Bottom 0.152: C35.1 36.92,33.16 36.42,32.66 v36.42,32.12
  Bottom 0.508: C8.2 C7.2
  other vias: 28.19,45.47 13.97,38.16 32.45,42.34 37.59,24.38 7.24,44.58 38.22,41.16 7.86,22.8 34.2,32.64 32.88,44.76 32.76,47.1 29.64,12.18 31.75,22.86 31.68,20.52 34.08,20.52 29.22,24.12 32.8,12 45.6,10.68 45.54,8.64 13.14,44.52 24.38,38.35 16.76,2.03 12.57,36.26 21.59,26.04 16.19,18.1 14.41,42.42 26.92,40.51 15.75,24.51 21.59,27.62 19.11,18.61 24.19,20.89 19.49,46.04 28.13,26.35 35.43,18.03 1.27,38.16 1.27,36.89 1.27,35.62 1.27,34.35 1.27,33.08 1.27,31.81 1.27,30.54 1.27,29.27 1.27,28 1.27,26.73 2.54,26.73 2.54,28 2.54,29.27 2.54,30.54 2.54,31.81 2.54,33.08 2.54,34.35 2.54,35.62 2.54,36.89 2.54,38.16 1.27,39.43 1.27,40.7 1.27,41.97 1.27,25.46 1.27,24.19 1.27,22.92 2.54,22.92 2.54,21.65 1.27,21.65 1.27,14.03 1.27,12.76 1.27,11.49 1.27,10.22 2.54,11.49 2.54,12.76 2.54,14.03 3.81,14.03 3.81,12.76 3.81,11.49 5.08,11.49 5.08,12.76 5.08,14.03 6.35,14.03 6.35,12.76 6.35,11.49 7.62,11.49 3.81,17.84 1.27,17.84 1.27,15.3 2.54,10.22 3.81,10.22 3.81,5.14 3.81,6.41 1.27,3.87 2.54,3.87 3.81,3.87 5.08,3.87 6.35,3.87 7.62,3.87 25.4,3.87 25.4,2.6 20.32,10.22 19.05,10.22 21.59,10.22 20.32,7.68 21.59,7.68 19.05,7.68 34.29,8.95 34.29,7.68 34.29,6.41 41.91,14.03 40.64,12.76 41.91,11.49 43.18,12.76 45.72,12.76 48.26,12.76 46.99,14.03 44.45,14.03 43.18,15.3 50.8,10.22 48.26,6.41 46.99,6.41 49.53,6.41 48.26,2.6 48.26,1.33 66.04,1.33 67.31,1.33 68.58,1.33 69.85,1.33 71.12,1.33 72.39,1.33 67.31,2.6 66.04,2.6 68.58,2.6 68.58,5.14 67.31,5.14 66.04,5.14 64.77,5.14 69.85,5.14 71.12,5.14 72.39,6.41 72.39,7.68 71.12,7.68 71.12,8.95 72.39,8.95 72.39,10.22 72.39,11.49 71.12,11.49 72.39,12.76 68.58,7.68 68.58,6.41 69.85,6.41 69.85,7.68 71.12,6.41 72.39,5.14 3.81,29.27 3.81,30.54 3.81,31.81 3.81,33.08 3.81,34.35 5.08,34.35 5.08,33.08 5.08,31.81 5.08,30.54 5.08,29.27 6.35,29.27 6.35,28 6.35,26.73 7.62,26.73 7.62,28 7.62,29.27 7.62,30.54 6.35,30.54 6.35,31.81 7.62,31.81 6.35,33.08 7.62,33.08 7.62,34.35 6.35,34.35 6.35,35.62 7.62,35.62 7.62,36.89 6.35,36.89 5.08,36.89 5.08,38.16 3.81,38.16 6.35,38.16 5.08,26.73 6.35,25.46 7.62,25.46 8.89,25.46 11.43,25.46 2.54,41.97 3.81,41.97 5.08,41.97 6.35,41.97 7.62,12.76 1.27,44.51 2.54,44.51 3.81,44.51 2.54,45.78 1.27,45.78 1.27,47.05 1.27,48.32 1.27,49.59 2.54,49.59 2.54,50.86 1.27,50.86 3.81,50.86 15.24,48.32 16.51,48.32 17.78,48.32 11.43,34.35 11.43,33.08 11.43,31.81 11.43,30.54 11.43,29.27 11.43,28 11.43,26.73 72.39,35.62 72.39,36.89 72.39,38.16 71.12,38.16 71.12,36.89 69.85,38.16 68.58,38.16 67.31,38.16 69.85,36.89 67.31,30.54 67.31,29.27 67.31,28 67.31,26.73 67.31,25.46 67.31,24.19 67.31,22.92 67.31,21.65 67.31,20.38 67.31,19.11 67.31,17.84 67.31,15.3 67.31,14.03 66.04,14.03 64.77,14.03 66.04,12.76 67.31,12.76 43.18,17.84 43.18,20.38 43.18,22.92 43.18,25.46 43.18,28 43.18,30.54 43.18,33.08 43.18,35.62 43.18,38.16 43.18,40.7 44.45,39.43 44.45,36.89 44.45,34.35 44.45,31.81 44.45,29.27 44.45,26.73 44.45,24.19 44.45,21.65 44.45,19.11 44.45,16.57 46.99,16.57 46.99,19.11 46.99,21.65 46.99,24.19 46.99,26.73 46.99,29.27 46.99,31.81 46.99,34.35 46.99,36.89 46.99,39.43 45.72,40.7 45.72,38.16 45.72,35.62 45.72,33.08 45.72,30.54 45.72,28 45.72,25.46 45.72,22.92 45.72,20.38 45.72,17.84 45.72,15.3 48.26,15.3 48.26,17.84 48.26,20.38 48.26,22.92 48.26,25.46 48.26,28 48.26,30.54 48.26,33.08 48.26,35.62 48.26,38.16 48.26,40.7 49.53,39.43 49.53,36.89 49.53,34.35 49.53,31.81 49.53,29.27 49.53,26.73 49.53,24.19 49.53,21.65 49.53,19.11 49.53,16.57 52.07,16.57 52.07,19.11 52.07,21.65 52.07,24.19 52.07,26.73 52.07,29.27 52.07,31.81 52.07,34.35 52.07,36.89 52.07,39.43 50.8,40.7 50.8,38.16 50.8,35.62 50.8,33.08 50.8,30.54 50.8,28 50.8,25.46 50.8,22.92 50.8,20.38 50.8,17.84 50.8,15.3 53.34,15.3 53.34,17.84 53.34,20.38 53.34,22.92 53.34,25.46 53.34,28 53.34,30.54 53.34,33.08 53.34,35.62 53.34,38.16 53.34,40.7 54.61,39.43 54.61,36.89 54.61,34.35 54.61,31.81 54.61,29.27 54.61,26.73 54.61,24.19 54.61,21.65 54.61,19.11 54.61,16.57 57.15,16.57 57.15,19.11 57.15,21.65 57.15,24.19 57.15,26.73 57.15,29.27 57.15,31.81 57.15,34.35 57.15,36.89 57.15,39.43 55.88,40.7 55.88,38.16 55.88,35.62 55.88,33.08 55.88,30.54 55.88,28 55.88,25.46 55.88,22.92 55.88,20.38 55.88,17.84 55.88,15.3 58.42,15.3 58.42,17.84 58.42,20.38 58.42,22.92 58.42,25.46 58.42,28 58.42,30.54 58.42,33.08 58.42,35.62 58.42,38.16 58.42,40.7 59.69,39.43 59.69,36.89 59.69,34.35 59.69,31.81 59.69,29.27 59.69,26.73 59.69,24.19 59.69,21.65 59.69,19.11 59.69,16.57 62.23,16.57 62.23,19.11 62.23,21.65 62.23,24.19 62.23,26.73 62.23,29.27 62.23,31.81 62.23,34.35 62.23,36.89 62.23,39.43 60.96,40.7 60.96,38.16 60.96,35.62 60.96,33.08 60.96,30.54 60.96,28 60.96,25.46 60.96,22.92 60.96,20.38 60.96,17.84 60.96,15.3 64.77,19.11 64.77,21.65 64.77,24.19 64.77,26.73 64.77,29.27 64.77,31.81 64.77,34.35 64.77,36.89 64.77,39.43 63.5,40.7 63.5,38.16 63.5,35.62 63.5,33.08 63.5,30.54 63.5,28 63.5,25.46 63.5,22.92 63.5,20.38 63.5,17.84 45.72,43.24 46.99,41.97 49.53,41.97 48.26,43.24 50.8,43.24 52.07,41.97 54.61,41.97 53.34,43.24 55.88,43.24 57.15,41.97 48.26,45.78 49.53,44.51 52.07,44.51 50.8,45.78 53.34,45.78 54.61,44.51 57.15,44.51 55.88,45.78 58.42,43.24 59.69,41.97 62.23,41.97 62.23,44.51 60.96,45.78 59.69,47.05 62.23,47.05 63.5,45.78 64.77,41.97 67.31,41.97 66.04,43.24 66.04,40.7 40.64,26.73 40.64,25.46 40.64,24.19 40.64,20.38 40.64,19.11 40.64,17.84 40.64,15.3 40.64,29.27 39.37,25.46 40.64,22.92 43.69,50.86 37.85,49.47 57.4,48.83 59.82,48.7 54.61,51.88 52.07,51.88 49.53,51.88 46.99,51.88 57.15,51.88 59.69,51.88 62.23,51.88 40.39,51.88 13.65,27.62 19.37,29.53
  pour Top: 2.54,0 71.12,0 arc90 73.66,2.54 73.66,38.1 73.66,50.8 arc90 71.12,53.34 2.5,53.34 arc90 0,50.84 0,2.54 arc90
  pour Bottom: 2.54,53.34 arc90 0,50.8 0,2.54 arc90 2.54,0 71.12,0 arc90 73.66,2.54 73.66,50.8 arc90 71.12,53.34
  pour Route15: 2.54,53.34 arc90 0,50.8 0,2.54 arc90 2.54,0 71.12,0 arc90 73.66,2.54 73.66,50.8 arc90 71.12,53.34
GPIO0
  Top 0.15: IC9.25 24.33,39.99 24.97,39.36 28.43,39.36 28.91,38.88 28.91,38.33 27.88,37.3 D6.2
  Top 0.152: Q2.3 22.68,44.37 22.68,43.97 24.33,42.32 24.33,40.64 IC9.25 25.18,41.22 R17.2
MISO/D12/EMAC_TXD0/GPIO19  (via drill 0.35)
  Top 0.15: IC9.31 16.71,39.17 v16.89,38.99 | IC11.12 31.65,35.27 30.76,36.15 v30.76,36.28
  Bottom 0.15: v16.89,38.99 17.14,38.99 18.73,40.58 25.38,40.58 28.92,37.04 30,37.04 v30.76,36.28
MISO/D12/GPIO19  (via drill 0.3, 0.35)
  Top 0.152: IC6.4 34.71,36.88 v34.51,36.69
  Top 0.2: IC11.22 28.28,29.97 v28.28,29.08
  Route15 0.15: v34.51,36.69 34.51,35.55 29.79,30.82 29.79,29.65 29.22,29.08 v28.28,29.08
MISO/D12/GPIO19_5V
  Top 0.152: IC6.17 34.71,40.74 34.59,40.86 34.59,47.61 33.28,48.92 32,48.92 31.5,49.43 JHIGH1.5
MOSI/D11/EMAC_MDC/GPIO23  (via drill 0.35)
  Top 0.15: IC9.37 9.27,40.19 v9.27,38.99 | IC11.10 32.65,36.23 31.86,37.02 29.5,37.02 28.62,36.14 27.17,36.14 v26.93,36.39
  Bottom 0.15: v9.27,38.99 9.5,38.99 11.24,37.24 15.94,37.24 16.75,38.05 21.48,38.05 22.62,39.2 24.64,39.2 27.19,36.65 v26.93,36.39
MOSI/D11/GPIO23  (via drill 0.3, 0.35)
  Top 0.15: 38.23,38.61 38.36,38.47 v39.03,38.47
  Top 0.152: IC6.7 35.93,38.24 35.93,38.83 36.09,38.99 37.32,38.99 37.85,38.99 38.23,38.61
  Top 0.2: IC11.26 31.2,30.79 31.2,30.39 31.1,30.3 31.1,29.84 30.09,28.83 v30.09,28.27
  Route15 0.15: v30.09,28.27 30.59,28.77 30.59,30.72 36.45,36.58 37.59,36.58 39.03,38.02 v39.03,38.47
MOSI/D11/GPIO23_5V
  Top 0.152: JHIGH1.4 34.04,48.64
  Top 0.2: 34.04,48.64 34.04,48.59 35.14,47.49 35.14,46.4 36.13,45.41 36.13,40.99 35.91,40.77 IC6.14
N$1
  Top 0.203: R1.2 11.47,44.58 10.32,43.43 J4.S2
  Bottom 0.254: J4.S2 J4.S4 2.16,44.15 2.01,44.29 2.01,51.08 2.16,51.23 J4.S3 J4.S1
N$3
  Top 0.152: IC10.9 30.6,44.55 31.14,44.55 31.29,44.7 31.42,44.83 31.42,45.2 31.58,45.36 31.88,45.36 31.96,45.44 R13.2
N$4
  Top 0.152: IC10.11 30.58,45.43 31.02,45.43 31.3,45.72 31.3,46.34 31.8,46.83 R14.2
N$5
  Top 0.152: R16.1 17.22,45.94 Q1.1
N$6
  Top 0.254: R9.2 12V.C
N$7
  Top 0.305: U3.8 37.03,10.54 37.43,10.15 39.25,10.15 R104.2
N$8
  Top 0.406: Q3.1 68.09,51.68 70.36,51.68 70.75,51.29 70.75,49.89 69.79,48.93 IC1.1
N$9
  Top 0.152: Q2.1 20.49,46.58 R15.1
N$10
  Top 0.152: D6.3 30.28,37.9 27.97,40.22 R17.1
N$12
  Top 0.254: R11.2 5V.C
N$13
  Top 0.254: 3.3V.C R12.2
N$14
  Top 0.254: J9.16 J9.15
  Top 0.305: J9.16 10.24,4.62 C21.1
N$19  (via drill 0.35)
  Top 0.305: v5.15,49.99 6.11,49.99 6.27,50.15 J4.A4_B9 | v5.28,45.51 6.11,45.51 6.27,45.35 J4.B4_A9
  Bottom 0.305: v5.15,49.99 F1.1 v5.28,45.51
N$24
  Top 0.2: U2.9 34.64,25.62 R28.1
N$25
  Top 0.2: U2.8 36.37,24.51 R32.1
N$36  (via drill 0.35)
  Top 0.254: U2.13 32.64,24.73 32.3,25.07 32.3,25.08 31.73,25.65 v31.69,25.65
  Bottom 0.254: R49.1 33.49,26.18 32.84,26.18 32.31,25.65 v31.69,25.65
N$37
  Top 0.2: U2.7 35.8,22.97 36.2,23.37 R50.1
N$38
  Top 0.2: U2.19 29.46,22.47 C43.1
  Top 0.406: R55.1 28.31,22.61 28.53,22.61 28.64,22.72 C43.1
N$39  (via drill 0.35)
  Top 0.127: U2.32 35.32,19.28 R56.2
  other vias: 35.43,19.17
N$40  (via drill 0.35)
  Top 0.089: U2.3 35.71,20.97 36.39,21.64 37.57,21.64 38.34,22.41 v38.89,22.41
  Bottom 0.089: v38.89,22.41 38.89,22.13 38.32,21.55 38.32,14.82 32.93,9.43 15.35,9.43 14.15,8.23 12.9,8.23 10.97,10.16 6.85,10.16 R58.1
N$41  (via drill 0.35)
  Top 0.089: U2.2 35.72,20.47 36,20.75 36,20.89 36.51,21.4 39.84,21.4 39.81,21.43 v40.19,21.81
  Bottom 0.089: v40.19,21.81 40.19,21.97 39.14,23.02 38.64,23.02 38.29,22.66 38.29,22.41 35.65,19.77 13.55,19.77 9.02,15.24 R57.1
OE_A  (via drill 0.35)
  Top 0.102: v41.89,43.23 41.58,43.55 41.58,46.31 41.41,46.49 41.36,46.49 40.8,46.49 IC2.6
  Bottom 0.2: R29.2 41.91,43.21 v41.89,43.23
OE_B
  Top 0.102: IC6.6 35.55,38.27 35.55,38.82 36,39.27 37.52,39.27 38.23,39.77 R30.2
OE_C
  Top 0.152: IC7.6 26.47,10.38 27.59,11.5 27.59,11.86 R31.2
PHY_VDD  (via drill 0.35)
  Top 0.152: U2.27 32.05,19.19 32.05,18.76 31.81,18.52 v31.81,18.16
  Top 0.2: C34.1 C33.1 36.94,20.54 C24.1 36.72,19.97 U2.1
  Top 0.254: C34.1 36.94,16.51 L5.2 36.8,16.37 36.25,15.82 R25.2 35.43,15.37 v35.56,15.24 | R24.2 32.83,15.76 | 32.83,15.76 33.34,15.25 v33.34,15.11 33.34,15.31 R27.2 33.78,15.76 32.83,15.76 | R26.2 30.6,15.24 v30.48,15.24 | J9.4 14.73,11.82 J9.5
  Bottom 0.152: v31.81,18.16 33.83,18.16 34.65,17.34 36.37,17.34 C34.1
  Bottom 0.203: J9.5 C9.1
  Bottom 0.254: v35.56,15.24 35.43,15.11 v33.34,15.11 30.61,15.11 v30.48,15.24 30.48,16.26 27.38,19.36 13.73,19.36 11.95,17.58 11.95,13.32 J9.5
  other vias: 36.99,17.91
RX_N  (via drill 0.35)
  Top 0.127: R27.1 33.99,16.82 | D7.3 21.84,14.01 22.71,14.01
  Top 0.152: R27.1 arc-45 33.64,17.31 U2.30 | 33.99,16.82 34.34,16.47 arc-45 34.48,16.13 34.48,15.67 arc-45 33.87,14.21 arc-45 32.41,13.6 26.52,13.6 arc-45 D9.1 25.28,13.76 arc-45 24.89,13.6 23.12,13.6 22.71,14.01 v22.67,13.97
  Bottom 0.152: J9.1 13.46,16.52 15.36,14.62 arc45 16.46,14.16 16.7,14.16 22.48,14.16 v22.67,13.97
RX_P  (via drill 0.35)
  Top 0.127: D7.1 22.2,12.38 22.68,12.88
  Top 0.152: U2.31 34.14,17.92 arc45 34.23,17.72 34.91,17.04 arc45 R25.1 35.24,16.82 34.91,16.48 arc45 34.76,16.13 34.76,15.67 arc-45 34.07,14.01 arc-45 32.41,13.32 26.52,13.32 arc45 D9.2 25.28,13.16 arc45 24.89,13.32 23.13,13.32 22.68,12.88 v22.67,12.86
  Bottom 0.152: J9.3 13.46,13.98 15.5,11.94 arc45 15.95,11.76 15.95,11.76 arc45 17.02,12.2 17.49,12.67 arc-45 17.94,12.86 v22.67,12.86
RXCAN/GPI36  (via drill 0.35)
  Top 0.203: U3.4 30.75,6.73 v30.48,6.46 | v10.92,6.73 10.92,18.2 12.19,19.46 12.19,20.92 11.63,21.48 IC9.4
  Bottom 0.203: v30.48,6.46 29.21,6.46 27.81,5.07 12.59,5.07 v10.92,6.73
SCK/D13/EMAC_MDIO/GPIO18  (via drill 0.35)
  Top 0.15: IC9.30 17.98,39.04 v18.03,38.99 | IC11.9 33.15,35.12 v33.28,35.25
  Bottom 0.15: v18.03,38.99 18.95,39.9 21.59,39.9 22,40.3 25.25,40.3 28.49,37.06 28.49,34.75 29.21,34.04 32.13,34.04 33.28,35.19 v33.28,35.25
SCK/D13/GPIO18  (via drill 0.35)
  Top 0.15: IC11.27 31.72,30.76 31.72,29.44 v31.62,29.34
  Top 0.152: IC6.3 34.31,37.61 v33.4,36.7
  Route15 0.15: v33.4,36.7 33.63,36.7 34.79,37.87 36.42,37.87 37.66,39.11 39.3,39.11 39.67,38.74 39.67,38.21 37.75,36.3 36.58,36.3 31.62,31.35 v31.62,29.34
SCK/D13/GPIO18_5V
  Top 0.152: IC6.18 34.31,47.5 33.16,48.64 30.73,48.64 28.96,50.42 JHIGH1.6
SCL/EMAC_TXD1/GPIO22  (via drill 0.35)
  Top 0.15: IC9.36 10.36,39.04 v10.41,38.99 | 30.07,34.85 30.15,34.78 IC11.15 30.07,34.51 30.07,34.85 | 30.07,34.85 29.87,35.05 28.45,35.05 v27.43,34.04
  Bottom 0.15: v10.41,38.99 10.41,38.48 10.44,38.46 10.44,38.44 11.36,37.52 15.7,37.52 16.51,38.33 21.36,38.33 22.51,39.47 24.88,39.47 27.56,36.8 27.56,34.16 v27.43,34.04
SCL/GPIO22  (via drill 0.35)
  Top 0.15: IC11.19 28.26,32.89 v27.96,32.6
  Top 0.152: IC6.1 32.55,39.23 v31.89,39.23
  Route15 0.15: v31.89,39.23 31.55,39.23 31.54,39.22 31.54,38.44 32.48,37.5 32.48,35.77 29.3,32.6 v27.96,32.6
SCL/GPIO22_5V
  Top 0.152: IC6.20 33.51,40.65 33.57,40.72 33.57,47.33 33.21,47.69 32.83,48.07 30.48,48.07 29.94,48.61 19.34,48.61 18.8,49.15 JHIGH1.10
SD_CLK/GPIO14_S
  Bottom 0.127: R22.2 18.03,28.5 18.24,28.71 18.26,28.71 18.59,29.05 18.59,30.48 20.49,32.38 J_SD_CLK.2
SD_CMD/GPIO15  (via drill 0.35)
  Bottom 0.203: J_SD_CMD.1 24.77,36.07 IC9.23
  other vias: 25.58,36.07
SD_CMD/GPIO15_S
  Bottom 0.127: R23.1 17.03,31.52 17.36,31.86 18.77,31.86 21.84,34.92 J_SD_CMD.2
  Bottom 0.203: MICRO_SD1.3 15.24,32.73 16.73,31.24 R23.1
SD_DAT0/GPIO2_S
  Bottom 0.127: R21.2 18.22,26.67 21.27,29.72 J-SD_DAT.2
  Bottom 0.203: R18.1 18.16,26.54 R21.2
SDA/EMAC_TX_EN/GPIO21  (via drill 0.35)
  Top 0.15: IC9.33 14.17,39.93 15.11,38.99 v15.78,38.99 | IC11.11 32.15,35.73 v31.84,36.03
  Bottom 0.15: v15.78,38.99 15.99,38.99 17.86,40.86 25.62,40.86 29.11,37.37 30.89,37.37 31.84,36.41 v31.84,36.03
SDA/GPIO21  (via drill 0.3, 0.35)
  Top 0.15: IC6.2 33.88,38.19 33.88,37.6 33.72,37.44 33.29,37.44 33.13,37.6 33.13,38.1 32.88,38.35 32.67,38.35 v32.6,38.28
  Top 0.2: IC11.23 29.6,30.79 29.6,30.41 29.08,29.9 v29.08,29.88
  Route15 0.15: v29.08,29.88 29.08,31.98 32.77,35.67 32.77,37.6 32.6,37.77 v32.6,38.28
SDA/GPIO21_5V
  Top 0.152: IC6.19 33.91,47.5 33.06,48.35 30.6,48.35 30.06,48.89 21.98,48.89 21.34,49.53 JHIGH1.9
TX_N  (via drill 0.35)
  Top 0.127: D7.4 18.86,14.49 v18.86,15.24
  Top 0.152: U2.28 32.64,18.19 arc-45 32.45,17.72 31.82,17.08 arc-45 R26.1 arc-45 31.52,16.68 31.72,16.48 arc-45 31.81,16.25 31.81,15 arc-45 31.62,14.54 arc-45 31.16,14.35 28.18,14.35 arc-45 27.64,14.57 arc-45 27.37,15.24 arc45 27,16.13 26.93,16.2 arc45 26.27,16.47 26.16,16.47 arc-45 25.65,16.68 25.58,16.75 | J9.2 16.13,15.5 17.38,15.5 arc45 17.83,15.69 18.43,16.29 arc-45 18.88,16.47 19.26,16.47 arc-90 19.78,15.96 19.78,15.89 arc90 20.01,15.66 20.25,15.66 arc90 20.49,15.89 20.49,17.05 arc-90 20.78,17.35 20.89,17.35 arc-90 21.19,17.05 21.19,15.89 arc90 21.43,15.66 21.67,15.66 arc90 21.9,15.89 21.9,15.96 arc-90 22.42,16.47 24.9,16.47 arc45 25.58,16.75 | D8.2 25.58,16.75
  Bottom 0.127: v18.86,15.24 16.39,15.24 J9.2
TX_P
  Top 0.127: D7.5 17.83,12.38 17.78,12.33
  Top 0.152: U2.29 33.14,18.23 arc-45 32.96,17.78 arc45 32.77,17.32 R24.1 arc45 32.36,16.65 32.19,16.48 arc45 32.09,16.25 32.09,15 arc-45 31.82,14.34 arc-45 31.16,14.07 28.18,14.07 arc-45 27.45,14.38 arc-45 27.09,15.24 arc45 26.8,15.93 26.73,16 26.43,16.13 arc45 25.61,15.79 25.58,15.76 | J9.6 17.77,12.32 arc45 17.78,12.33 17.78,14.97 arc-45 17.97,15.42 18.55,16.01 arc-45 19,16.19 19.26,16.19 arc-90 19.5,15.96 19.5,15.89 arc90 20.01,15.38 21.67,15.38 arc90 22.18,15.89 22.18,15.96 arc-90 22.42,16.19 24.83,16.19 arc-45 25.37,15.97 25.58,15.76 | 25.58,15.76 D8.1
TXCAN
  Top 0.152: CAN_TX.2 35.94,11.56 35.62,11.24 32.27,11.24 U3.1
USB_DATA_CON_N  (via drill 0.35)
  Top 0.152: J4.A7 7.62,47.5 | 7.62,47.5 8.38,47.5 9.33,46.55 IC3.6 | J4.B7 5.96,48.5 v5.9,48.56 | v7.93,47.37 7.75,47.37 7.62,47.5
  Bottom 0.152: v5.9,48.56 7.09,47.37 v7.93,47.37
USB_DATA_CON_P
  Top 0.152: J4.B6 6.91,47.08 6.22,47.08 6.06,47.24 6.06,47.77 6.22,47.93 6.91,47.93 J4.A6 8.31,48 8.76,48.45 IC3.4
USB_DATA_N
  Top 0.152: IC3.1 13.11,46.55 arc45 13.82,46.84 arc-45 15.07,47.36 21.9,47.36 arc-45 23.32,46.77 23.43,46.66 arc-45 23.6,46.26 23.6,44.83 arc45 24.31,43.11 24.87,42.55 arc45 26.28,41.97 26.67,41.97 | IC10.5 28.68,42.7 arc-45 28.5,42.26 arc-45 27.79,41.97 26.67,41.97 | 26.67,41.97
USB_DATA_P
  Top 0.152: IC3.3 13.04,48.45 arc-45 13.75,48.16 arc45 15,47.64 22.02,47.64 arc-45 23.43,47.05 23.71,46.77 arc-45 23.88,46.37 23.88,44.95 arc45 24.59,43.23 24.98,42.83 arc45 26.4,42.25 27.53,42.25 arc45 28.18,42.52 IC10.4
USB_DTR  (via drill 0.35)
  Top 0.152: v23.5,42.16 22.61,42.16 21.33,43.44 Q2.2 20.49,44.03 18.22,46.31 R16.2 | IC10.28 25.78,43.93 v25.78,43.18
  Bottom 0.152: v25.78,43.18 24.77,42.16 v23.5,42.16
USB_RTS  (via drill 0.35)
  Top 0.152: v17.72,43.31 16.75,43.31 Q1.2 | IC10.24 25.75,46.05 25.21,46.05 24.66,46.61 v24.64,46.61 | R15.2 v21.59,44.37
  Bottom 0.152: v17.72,43.31 18.8,44.39 21.59,44.39 | 21.59,44.39 22.28,44.39 24.5,46.61 v24.64,46.61 | v21.59,44.37 21.59,44.39
VBUS  (via drill 0.35)
  Top 0.152: IC10.8 30.6,44.05 31.14,44.05 31.82,44.73 R6.2 31.97,44.7 R10.2 R10.1
  Top 0.305: IC3.5 10.92,47.5 v11.43,46.99 | v34.8,48.83 34.8,48.39 35.86,47.33 v35.86,46.8
  Top 0.406: Q3.3 65.57,49.95 64.92,50.6 64.92,52.18 64.36,52.73 36.09,52.73 35.41,52.05 35.41,49.44 v34.8,48.83
  Bottom 0.305: v34.8,48.83 34.39,48.42 25.45,48.42 22.22,45.2 13.22,45.2 v11.43,46.99 10.99,46.55 5.54,46.55 F1.2 | v35.86,46.8 35.86,46.42 33,43.56 R10.2
  other vias: 31.97,43.56
VDD
  Bottom 0.203: 16.82,30.12 15.3,31.63 MICRO_SD1.4
  Bottom 0.254: MICRO_SD1.4 13.99,31.63 13.5,32.12 13.5,35.16 14.07,35.73 16.19,35.73 L1.2 | C5.2 17.28,29.65 16.82,30.12
VIN  (via drill 1)
  Top 0.152: U$10.P$1 v67.32,35.56
  Top 1.27: v67.32,35.56 67.39,35.49 69.66,35.49 71.76,33.39 71.76,27.15 | J5.2 70.48,26.03 70.64,26.03 71.76,27.15 | J6.2 70.48,13.33 70.64,13.33 71.76,14.45 71.76,27.15

## Text on the board
tPlace: 12 | SCL | SDA | REF | GND | 18 | 19 | 23 | 5 | 13 | 14 | 27 | 16 | 17 | 25 | 26 | TX | RX | NC | 5V | RST | 3.3V | 5V | GND | GND | VIN | 34 | 35 | 32 | 33 | 4 | 2 | DynoHub v1.0 / Daniel Jovanovic / F107
bPlace: Jump to / enable SD Card | CANH | CANL | VIN | GND | CANH | CANL | VIN | GND
tNames: RESET | CAN TX / TO IO | CAN / TERM | ETH DISABLE
tValues: RESET